# Altium schematic sheet MCU.SchDoc: Bluetooth MCU
size A3; Engineer: David; DocumentNumber: 3; SheetNumber: 3; SheetTotal: 9; Project: SmartCanton Dev Box; Labo: LSN; PageSetup: Record=PageOptions|CenterHorizontal=True|CenterVertical=True|PrintScale=0.97|XCorrection=1.00|YCorrection=1.00|PrintKind=1|BorderSize=5000000|LeftOffset=0|BottomOffset=0|Orientation=2|PaperLength=1000|PaperWidth=1000|Scale=100|PaperSource=7|PrintQuality=-3|MediaType=1|DitherType=10|PrintScaleMode=1|PaperKind=A4 (210 x 297 mm)|PaperIndex=9
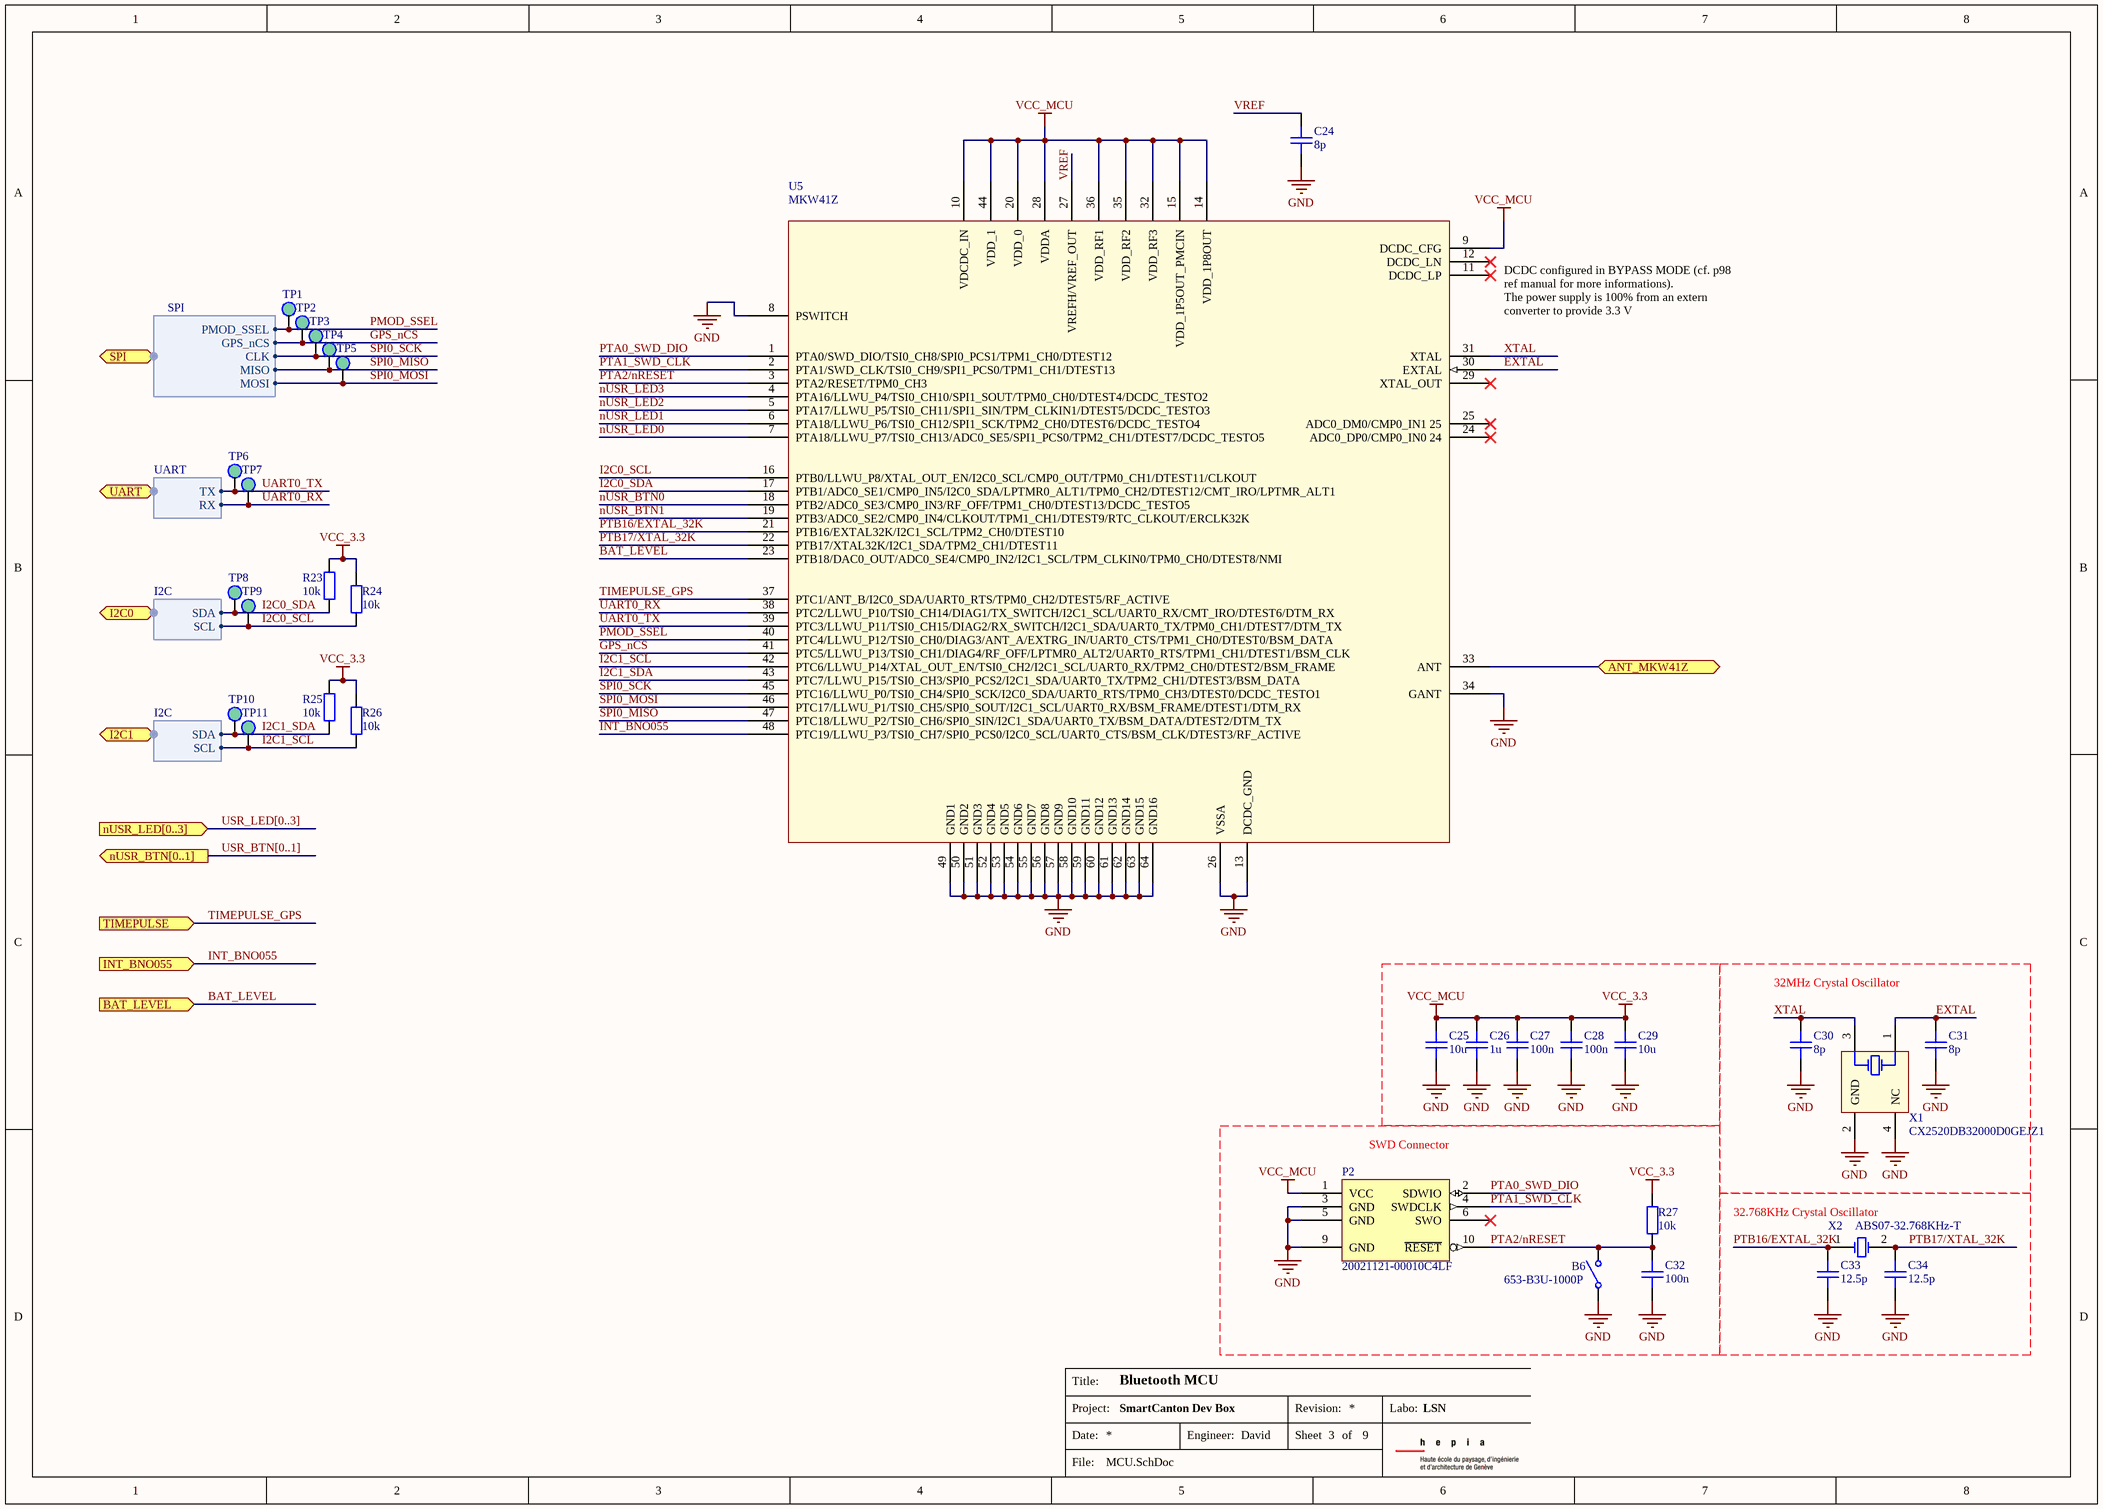
[diagram p0: MCU.SchDoc]

## Parts
B6  653-B3U-1000P  [B3U-1000P]
C24  8p  [CAPC1608X08]
C25  10u  [CAPC1608X08N]
C26  1u  [CAPC1608X08N]
C27  100n  [CAPC1608X08N]
C28  100n  [CAPC1608X08N]
C29  10u  [CAPC1608X08N]
C30  8p  [CAPC1608X08]
C31  8p  [CAPC1608X08]
C32  100n  [CAPC1608X08]
C33  12.5p  [CAPC1608X08]
C34  12.5p  [CAPC1608X08]
P2  20021121-00010C4LF  [PCBComponent]
R23  10k  [RESC1608X06]
R24  10k  [RESC1608X06]
R25  10k  [RESC1608X06]
R26  10k  [RESC1608X06]
R27  10k  [RESC1608X06]
TP1  5015  [5015]  (value not drawn)
TP2  5015  [5015]  (value not drawn)
TP3  5015  [5015]  (value not drawn)
TP4  5015  [5015]  (value not drawn)
TP5  5015  [5015]  (value not drawn)
TP6  5015  [5015]  (value not drawn)
TP7  5015  [5015]  (value not drawn)
TP8  5015  [5015]  (value not drawn)
TP9  5015  [5015]  (value not drawn)
TP10  5015  [5015]  (value not drawn)
TP11  5015  [5015]  (value not drawn)
U5  MKW41Z  [QFN50P700X700X80_HS-49M]
X1  CX2520DB32000D0GEJZ1  [AVX-CX2520DB32000D0GEJZ1-4_V]
X2  ABS07-32.768KHz-T  [ABRA-ABS07-2_V]

## Blocks framed on the sheet
32MHz Crystal Oscillator: C30 C31 X1
SWD Connector: B6 C32 P2 R27
32.768KHz Crystal Oscillator: C33 C34 X2

## Ports
ANT_MKW41Z, BAT_LEVEL (in), I2C0 (harness I2C), I2C1 (harness I2C), INT_BNO055 (in), nUSR_BTN[0..1] (out), nUSR_LED[0..3] (in), SPI (harness SPI), TIMEPULSE (in), UART (harness UART)

## Harnesses
SPI: GPS_nCS, CLK, MISO, MOSI, PMOD_SSEL
UART: TX, RX
I2C: SDA, SCL

## Nets
GND: B6.1 C24.1 C25.1 C26.1 C27.1 C28.1 C29.1 C30.1 C31.1 C32.1 C33.1 C34.1 P2.3(GND) P2.5(GND) P2.9(GND) U5.8(PSWITCH) U5.13(DCDC_GND) U5.26(VSSA) U5.34(GANT) U5.49(GND1) U5.50(GND2) U5.51(GND3) U5.52(GND4) U5.53(GND5) U5.54(GND6) U5.55(GND7) U5.56(GND8) U5.57(GND9) U5.58(GND10) U5.59(GND11) U5.60(GND12) U5.61(GND13) U5.62(GND14) U5.63(GND15) U5.64(GND16) X1.2(GND) X1.4(NC)
VCC_3.3: C25.2 C26.2 C27.2 C28.2 C29.2 P2.1(VCC) R23.2 R24.2 R25.2 R26.2 R27.1 U5.9(DCDC_CFG) U5.10(VDCDC_IN) U5.14(VDD_1P8OUT) U5.15(VDD_1P5OUT_PMCIN) U5.20(VDD_0) U5.28(VDDA) U5.32(VDD_RF3) U5.35(VDD_RF2) U5.36(VDD_RF1) U5.44(VDD_1)  [also labelled VCC_MCU]
ANT_MKW41Z: U5.33(ANT) ; port ANT_MKW41Z
BAT_LEVEL: U5.23(PTB18/DAC0_OUT/ADC0_SE4/CMP0_IN2/I2C1_SCL/TPM_CLKIN0/TPM0_CH0/DTEST8/NMI) ; port BAT_LEVEL
EXTAL: C31.2 U5.30(EXTAL) X1.1(HOT)
GPS_nCS: TP2.1(TP) U5.41(PTC5/LLWU_P13/TSI0_CH1/DIAG4/RF_OFF/LPTMR0_ALT2/UART0_RTS/TPM1_CH1/DTEST1/BSM_CLK) ; port SPI.GPS_nCS
I2C0_SCL: R24.1 TP9.1(TP) U5.16(PTB0/LLWU_P8/XTAL_OUT_EN/I2C0_SCL/CMP0_OUT/TPM0_CH1/DTEST11/CLKOUT) ; port I2C0.SCL
I2C0_SDA: R23.1 TP8.1(TP) U5.17(PTB1/ADC0_SE1/CMP0_IN5/I2C0_SDA/LPTMR0_ALT1/TPM0_CH2/DTEST12/CMT_IRO/LPTMR_ALT1) ; port I2C0.SDA
I2C1_SCL: R26.1 TP11.1(TP) U5.42(PTC6/LLWU_P14/XTAL_OUT_EN/TSI0_CH2/I2C1_SCL/UART0_RX/TPM2_CH0/DTEST2/BSM_FRAME) ; port I2C1.SCL
I2C1_SDA: R25.1 TP10.1(TP) U5.43(PTC7/LLWU_P15/TSI0_CH3/SPI0_PCS2/I2C1_SDA/UART0_TX/TPM2_CH1/DTEST3/BSM_DATA) ; port I2C1.SDA
INT_BNO055: U5.48(PTC19/LLWU_P3/TSI0_CH7/SPI0_PCS0/I2C0_SCL/UART0_CTS/BSM_CLK/DTEST3/RF_ACTIVE) ; port INT_BNO055
nUSR_BTN0: U5.18(PTB2/ADC0_SE3/CMP0_IN3/RF_OFF/TPM1_CH0/DTEST13/DCDC_TESTO5)
nUSR_BTN1: U5.19(PTB3/ADC0_SE2/CMP0_IN4/CLKOUT/TPM1_CH1/DTEST9/RTC_CLKOUT/ERCLK32K)
nUSR_LED0: U5.7(PTA18/LLWU_P7/TSI0_CH13/ADC0_SE5/SPI1_PCS0/TPM2_CH1/DTEST7/DCDC_TESTO5)
nUSR_LED1: U5.6(PTA18/LLWU_P6/TSI0_CH12/SPI1_SCK/TPM2_CH0/DTEST6/DCDC_TESTO4)
nUSR_LED2: U5.5(PTA17/LLWU_P5/TSI0_CH11/SPI1_SIN/TPM_CLKIN1/DTEST5/DCDC_TESTO3)
nUSR_LED3: U5.4(PTA16/LLWU_P4/TSI0_CH10/SPI1_SOUT/TPM0_CH0/DTEST4/DCDC_TESTO2)
PMOD_SSEL: TP1.1(TP) U5.40(PTC4/LLWU_P12/TSI0_CH0/DIAG3/ANT_A/EXTRG_IN/UART0_CTS/TPM1_CH0/DTEST0/BSM_DATA) ; port SPI.PMOD_SSEL
PTA0_SWD_DIO: P2.2(SDWIO) U5.1(PTA0/SWD_DIO/TSI0_CH8/SPI0_PCS1/TPM1_CH0/DTEST12)
PTA1_SWD_CLK: P2.4(SWDCLK) U5.2(PTA1/SWD_CLK/TSI0_CH9/SPI1_PCS0/TPM1_CH1/DTEST13)
PTA2/nRESET: B6.2 C32.2 P2.10(~{RESET}) R27.2 U5.3(PTA2/RESET/TPM0_CH3)
PTB16/EXTAL_32K: C33.2 U5.21(PTB16/EXTAL32K/I2C1_SCL/TPM2_CH0/DTEST10) X2.1(X1)
PTB17/XTAL_32K: C34.2 U5.22(PTB17/XTAL32K/I2C1_SDA/TPM2_CH1/DTEST11) X2.2(X2)
SPI0_MISO: TP4.1(TP) U5.47(PTC18/LLWU_P2/TSI0_CH6/SPI0_SIN/I2C1_SDA/UART0_TX/BSM_DATA/DTEST2/DTM_TX) ; port SPI.MISO
SPI0_MOSI: TP5.1(TP) U5.46(PTC17/LLWU_P1/TSI0_CH5/SPI0_SOUT/I2C1_SCL/UART0_RX/BSM_FRAME/DTEST1/DTM_RX) ; port SPI.MOSI
SPI0_SCK: TP3.1(TP) U5.45(PTC16/LLWU_P0/TSI0_CH4/SPI0_SCK/I2C0_SDA/UART0_RTS/TPM0_CH3/DTEST0/DCDC_TESTO1) ; port SPI.CLK
TIMEPULSE_GPS: U5.37(PTC1/ANT_B/I2C0_SDA/UART0_RTS/TPM0_CH2/DTEST5/RF_ACTIVE) ; port TIMEPULSE
UART0_RX: TP7.1(TP) U5.38(PTC2/LLWU_P10/TSI0_CH14/DIAG1/TX_SWITCH/I2C1_SCL/UART0_RX/CMT_IRO/DTEST6/DTM_RX) ; port UART.RX
UART0_TX: TP6.1(TP) U5.39(PTC3/LLWU_P11/TSI0_CH15/DIAG2/RX_SWITCH/I2C1_SDA/UART0_TX/TPM0_CH1/DTEST7/DTM_TX) ; port UART.TX
VREF: C24.2 U5.27(VREFH/VREF_OUT)
XTAL: C30.2 U5.31(XTAL) X1.3(HOT)

Not connected (* = marked no-connect by the designer): P2 6(SWO)*; U5 11(DCDC_LP)* 12(DCDC_LN)* 24(ADC0_DP0/CMP0_IN0_24)* 25(ADC0_DM0/CMP0_IN1_25)* 29(XTAL_OUT)*

## Buses and harness runs
bus USR_BTN[0..1] = port nUSR_BTN[0..1]
bus USR_LED[0..3] = port nUSR_LED[0..3]

## Notes on the sheet
- DCDC configured in BYPASS MODE (cf. p98 ref manual for more informations).
  The power supply is 100% from an extern converter to provide 3.3 V
- Title:
- Date:
- Project:
- Engineer:
- Revision:
- Sheet
- of
- Labo:
- File:

## Library data of the parts
B6 = PUSH_BUTTON: Supplier 1: Mouser; Supplier Part Number 1: 653-B3U-1000P
C24 C30 C31 C33 C34 = CMP-001-0010-A.3: MLCC Capacitor 1608; RevisionId: A.2; AccessRights: 2147483647; Folder: LSN\Components\Passifs\Condensateurs\; ContentType: Component; LifeCycleStateGUID: 706004B5-C76E-482E-903B-BA0E4FAE086A; ReleaseDate: 31/10/2016 02:21:03 PM; ContentTypeGUID: CB3C11C4-E317-11DF-B822-12313F0024A2; ItemGUID: 6B05C9AF-D3C2-4723-98C2-0E51694C471A; ItemHRID: CMP-001-0010; FolderGUID: 9DA6C5B0-B134-4C0D-99DA-A840DED25FBD; LifeCycle: New From Design; ComponentType: Capacitor
  C24 C30 C31: Value: 8p
  C33 C34: Value: 12.5p
C25-C29 = CMP-001-0010-A.1: MLCC Capacitor 1608
  C25 C29: Value: 10u
  C26: Value: 1u
  C27 C28: Value: 100n
C32 = CMP-001-0010-A.3: MLCC Capacitor 1608; AccessRights: 2147483647; ContentType: Component; Folder: LSN\Components\Passifs\Condensateurs\; RevisionId: A.2; Value: 100n; ComponentType: Capacitor; ContentTypeGUID: CB3C11C4-E317-11DF-B822-12313F0024A2; FolderGUID: 9DA6C5B0-B134-4C0D-99DA-A840DED25FBD; ItemGUID: 6B05C9AF-D3C2-4723-98C2-0E51694C471A; ItemHRID: CMP-001-0010; LifeCycle: New From Design; LifeCycleStateGUID: 706004B5-C76E-482E-903B-BA0E4FAE086A; ReleaseDate: 31/10/2016 02:21:03 PM
P2 = CMP-001-0019-A.2: Minitek127®  :  1.27x1.27MM BTB, HEADER UNSHROUDED, SMT, 10 POSITIONS; Supplier 1: Mouser; Supplier Part Number 1: 649-202112100010C4LF
R23-R27 = CMP-001-0005-A.4: 1608 resistor; Value: 10k
TP1-TP11 = CMP-001-0108-A.3: Circuit Board Hardware - PCB MINI SMT TEST POINT
U5 = CMP-001-0100-A.1: 2.4 GHz Bluetooth Low Energy ver. 4.2 compliant, Up to 48 MHz ARM® Cortex-M0+ core, On-chip 512/256 KB Flash memory, On-chip 128/64 KB SRAM; Supplier 1: Mouser; Supplier Part Number 1: 841-MKW41Z512VHT4
X1 = CMP-0449-00001-2: Crystal, 32 MHz, 8 pF, -10 to 70 degC, Surface Mount 2.5 x 2.0 mm; Manufacturer: Kyocera; Load Capacitance: 8 pF; Frequency Range: 32000 kHz; Packing: Tape and Reel; Motional Series Resistance: 50 ohm (max); Drive Level: 10uW (100uW max.); ComponentLink3Description: Package Specification; ComponentLink1Description: Manufacturer URL; ComponentLink2Description: Datasheet; PackageDescription: 4-Pin Hand Drawnï¼ŒBody 2.5x2mm; ComponentLink1URL: http://global.kyocera.com/; ComponentLink3URL: http://global.kyocera.com/prdct/electro/pdf/xtal/cx2520db_cs_e.pdf; Operating Temperature: -10 to 70 degC; ComponentLink2URL: http://global.kyocera.com/prdct/electro/pdf/xtal/cx2520db_cs_e.pdf; PartNumber: CX2520DB32000D0GEJZ1; PackageReference: CX2520DB32000D0GEJZ1-4; Mounting Technology: Surface Mount; Supplier 1: Mouser; Supplier Part Number 1: 581-CX2520DB32DGEJZ1
X2 = CMP-0447-00001-2: Crystal, 32.768 kHz, 12.5 pF, -40 to 85 degC, SMD Low Profile 3.2 x 1.5 x 0.9 mm, Tape and Reel; Manufacturer: Abracon; Q Value (Type): 30000; Operation Mode: Flexural Mode (Tuning Fork); Shunt Capacitance (C0): 0.9 to 1.2 pF; Load Capacitance (CL): 12.5 pF; Frequency Tolerance @+25degC: +/- 20 ppm; Drive Level (Type): 0.1 uW; Equivalent Series Resistance (R1): 70 Kohm; Insulation Resistance (Min): 500 Mohm; ComponentLink3URL: http://www.abracon.com/Resonators/ABS07.pdf; PackageDescription: 2-Pin Hand Drawn, Body 3.2x1.5mm, Pitch 2.5mm; Operating Temperature: -40 to 85 degC; ComponentLink2URL: http://www.abracon.com/Resonators/ABS07.pdf; PackageReference: ABS07-2; ComponentLink3Description: Package Specification; ComponentLink1Description: Manufacturer URL; DatasheetVersion: 04.03.13; Mounting Technology: Surface Mount; ComponentLink2Description: Datasheet; ComponentLink1URL: http://www.abracon.com/; PartNumber: ABS07-32.768KHz-T; Packing: Tape and Reel; Frequency: 32.768 kHz; Supplier 1: Mouser; Supplier Part Number 1: 815-ABS07-32.768KHZT